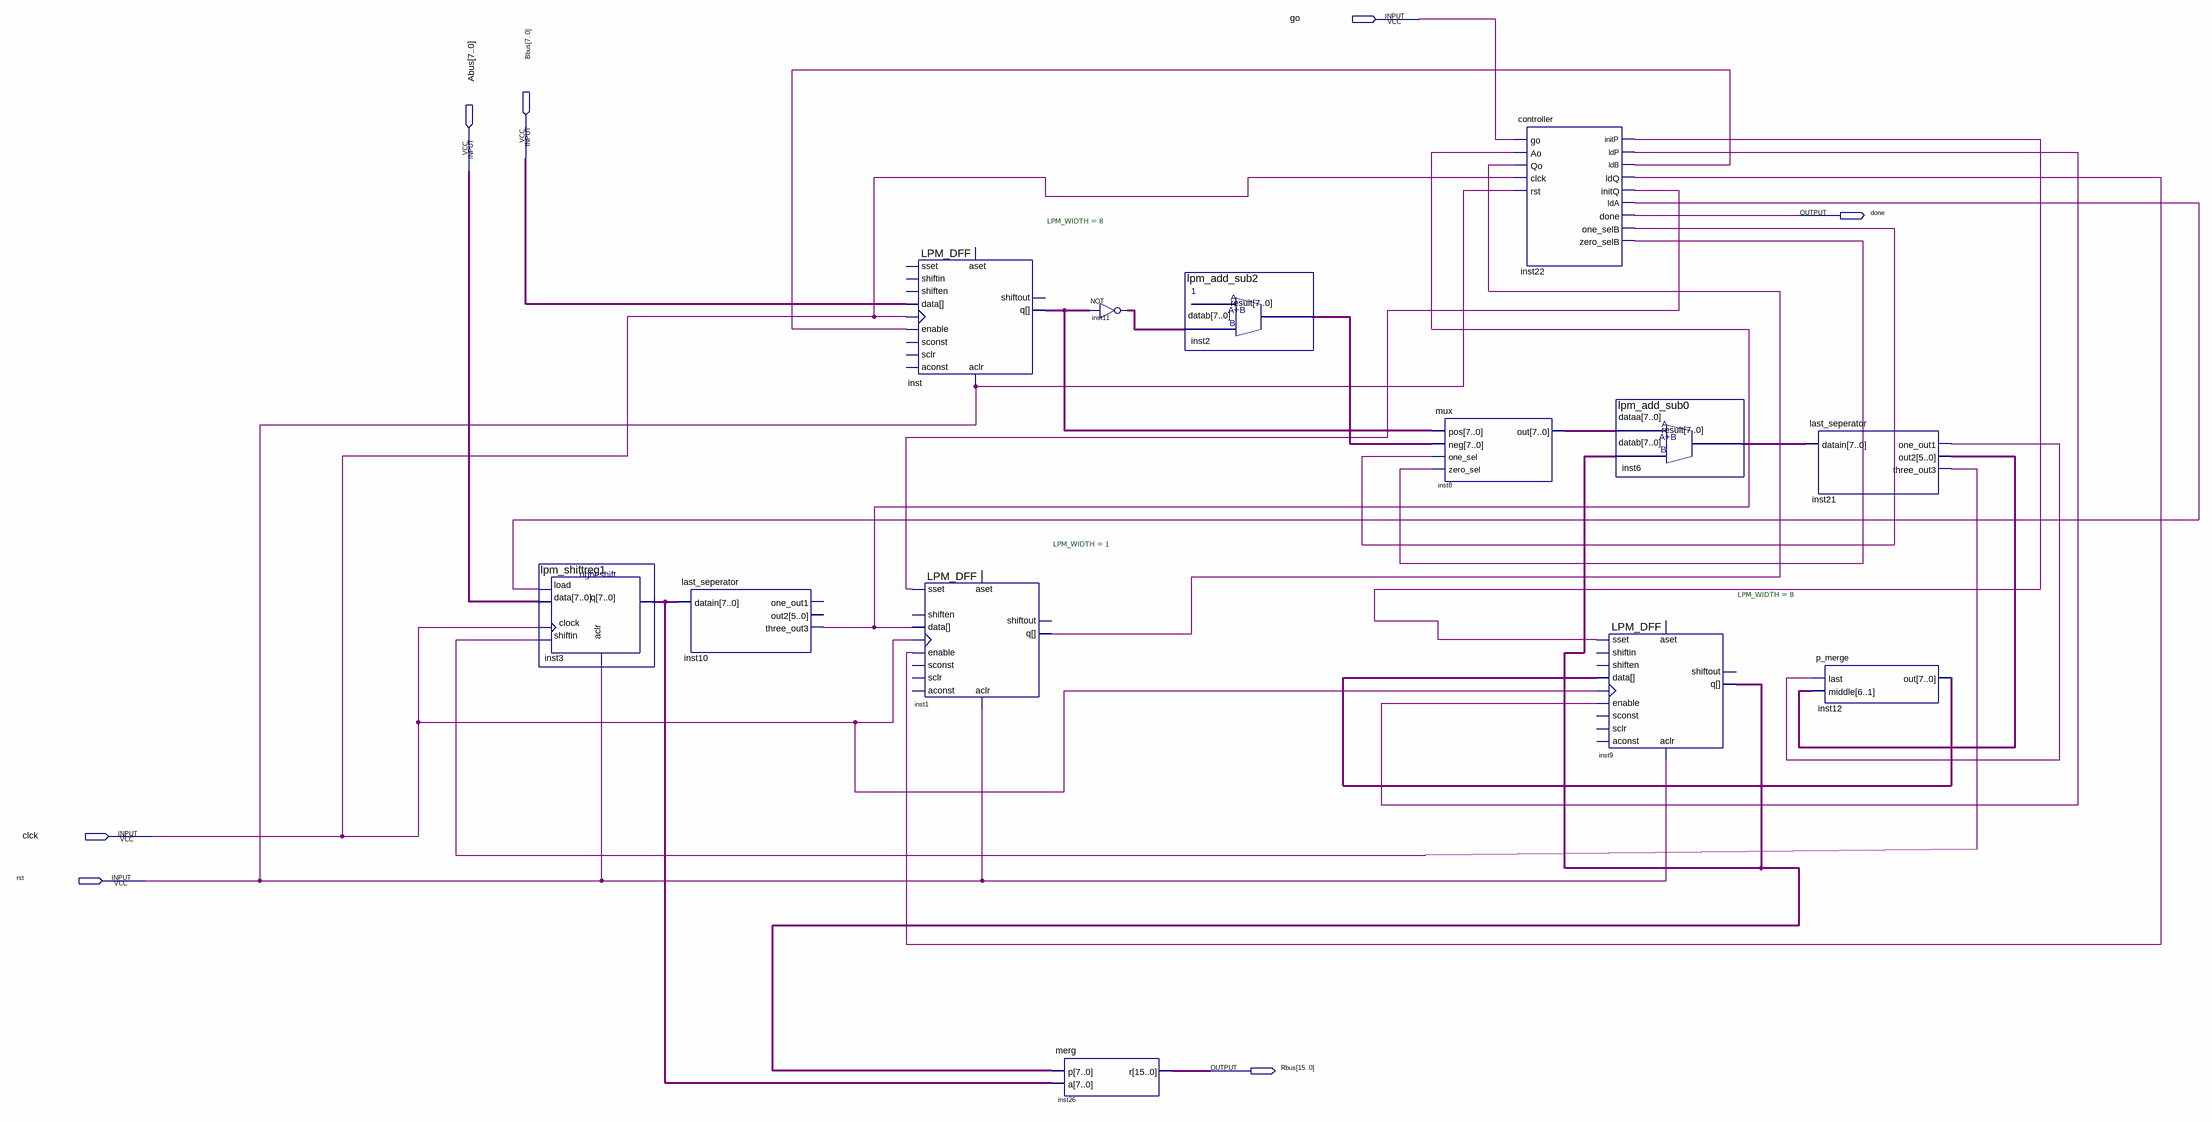
[diagram p0: schematic sheet]
// Quartus schematic mult_dp.bdf as structural Verilog: 13 symbols, 7 pins
module mult_dp (
  input  go,
  input  [7:0] Bbus,
  input  [7:0] Abus,
  input  clck,
  input  rst,
  output done,
  output [15:0] Rbus
);

  wire inst1_q, inst10_three_out3, inst21_one_out1, inst21_three_out3, inst22_initp, inst22_initq,
       inst22_lda, inst22_ldb, inst22_ldp, inst22_ldq, inst22_one_selb, inst22_zero_selb;
  wire [5:0] inst21_out2;
  wire [7:0] inst2_result, inst3_q, inst6_result, inst8_out, inst9_q, inst11_out, inst12_out, inst_q;

  lpm_shiftreg1 inst3 (
    .load(inst22_lda), .data(Abus), .clock(clck), .shiftin(inst21_three_out3), .aclr(rst), .q(inst3_q));
  last_seperator inst10 (.datain(inst3_q), .three_out3(inst10_three_out3));  // open: one_out1, out2
  LPM_DFF #(.LPM_WIDTH(8)) inst (
    .enable(inst22_ldb), .clock(clck), .data(Bbus), .aclr(rst), .q(inst_q));  // open: shiftin, shiften, aconst, sclr, sconst, sset, aset, shiftout
  LPM_DFF #(.LPM_WIDTH(1)) inst1 (
    .aclr(rst), .clock(clck), .data(inst10_three_out3), .enable(inst22_ldq), .sset(inst22_initq), .q(inst1_q));  // open: aconst, aset, sclr, sconst, shiften, shiftout
  merg inst26 (.p(inst9_q), .a(inst3_q), .r(Rbus));
  assign inst11_out = ~inst_q;  // NOT inst11, 8 bits wide
  lpm_add_sub2 inst2 (.datab(inst11_out), .result(inst2_result));
  mux inst8 (.pos(inst_q), .neg(inst2_result), .one_sel(inst22_one_selb), .zero_sel(inst22_zero_selb), .out(inst8_out));
  controller inst22 (
    .go(go), .Ao(inst10_three_out3), .Qo(inst1_q), .clck(clck), .rst(rst), .initP(inst22_initp),
    .ldP(inst22_ldp), .ldB(inst22_ldb), .ldQ(inst22_ldq), .initQ(inst22_initq), .ldA(inst22_lda),
    .done(done), .one_selB(inst22_one_selb), .zero_selB(inst22_zero_selb));
  lpm_add_sub0 inst6 (.dataa(inst8_out), .datab(inst9_q), .result(inst6_result));
  LPM_DFF #(.LPM_WIDTH(8)) inst9 (
    .enable(inst22_ldp), .clock(clck), .data(inst12_out), .sset(inst22_initp), .aclr(rst), .q(inst9_q));  // open: shiftin, shiften, aconst, sclr, sconst, aset, shiftout
  last_seperator inst21 (
    .datain(inst6_result), .one_out1(inst21_one_out1), .out2(inst21_out2), .three_out3(inst21_three_out3));
  p_merge inst12 (.last(inst21_one_out1), .middle(inst21_out2), .out(inst12_out));
endmodule
